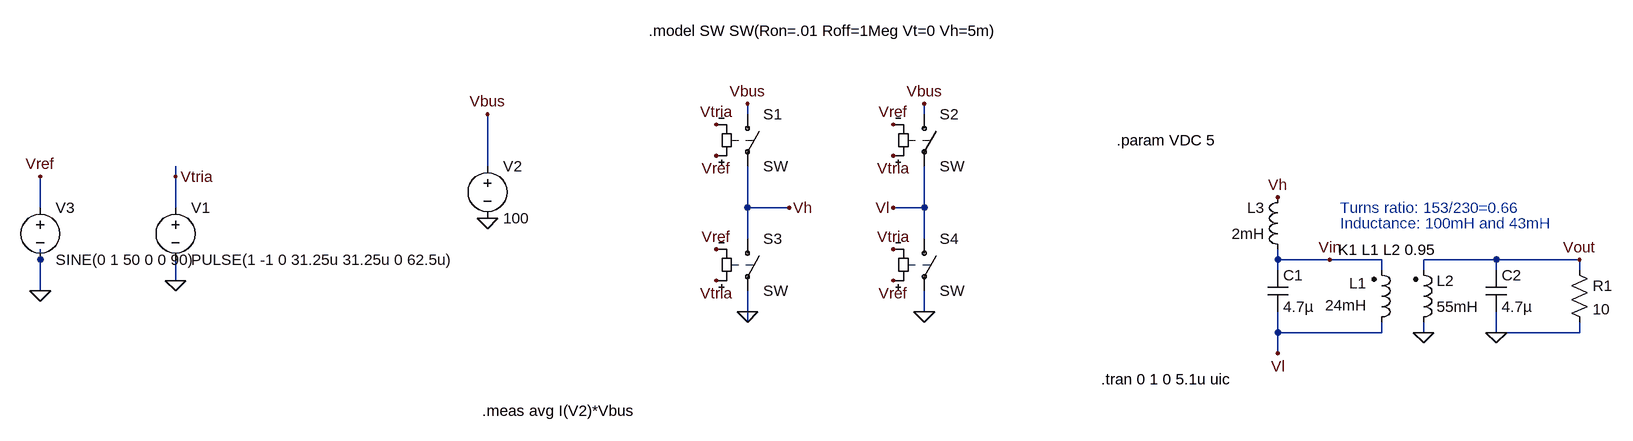
[diagram p0: schematic SB2500.asc]
SB2500.asc, the LTspice schematic file:
Version 4
SHEET 1 880 680
WIRE -1184 -128 -1184 -144
WIRE -912 -128 -912 -144
WIRE -1584 -48 -1584 -128
WIRE -2064 -32 -2064 -48
WIRE -2272 16 -2272 -32
WIRE -2064 16 -2064 -32
WIRE -1184 16 -1184 -48
WIRE -1120 16 -1184 16
WIRE -912 16 -912 -48
WIRE -912 16 -960 16
WIRE -1184 64 -1184 16
WIRE -912 64 -912 16
WIRE -2272 96 -2272 80
WIRE -368 96 -368 80
WIRE -288 96 -368 96
WIRE -208 96 -288 96
WIRE -32 96 -144 96
WIRE 96 96 -32 96
WIRE -368 112 -368 96
WIRE -208 112 -208 96
WIRE -144 112 -144 96
WIRE -32 112 -32 96
WIRE 96 112 96 96
WIRE -2064 128 -2064 96
WIRE -2272 144 -2272 96
WIRE -1184 176 -1184 144
WIRE -912 176 -912 144
WIRE -1184 192 -1184 176
WIRE -368 208 -368 176
WIRE -208 208 -208 192
WIRE -208 208 -368 208
WIRE -144 208 -144 192
WIRE -32 208 -32 176
WIRE 96 208 96 192
WIRE 96 208 -32 208
WIRE -368 240 -368 208
FLAG -144 208 0
FLAG -32 208 0
FLAG -368 0 Vh
FLAG -1584 32 0
FLAG -1184 176 0
FLAG -912 176 0
FLAG -1584 -128 Vbus
FLAG -1184 -144 Vbus
FLAG -912 -144 Vbus
FLAG -1120 16 Vh
FLAG -960 16 Vl
FLAG -2064 128 0
FLAG -2064 -32 Vtria
FLAG -2272 144 0
FLAG -2272 -32 Vref
FLAG -1232 -64 Vref
FLAG -1232 80 Vref
FLAG -960 -64 Vtria
FLAG -960 80 Vtria
FLAG -960 -112 Vref
FLAG -960 128 Vref
FLAG -368 240 Vl
FLAG -1232 -112 Vtria
FLAG -1232 128 Vtria
FLAG 96 96 Vout
FLAG -288 96 Vin
SYMBOL ind2 -224 208 M180
WINDOW 0 -7 76 Right 2
WINDOW 3 -7 42 Right 2
SYMATTR InstName L1
SYMATTR Value 24mH
SYMATTR Type ind
SYMATTR SpiceLine Rser=0.1
SYMBOL ind2 -160 208 M180
WINDOW 0 36 80 Left 2
WINDOW 3 36 40 Left 2
SYMATTR InstName L2
SYMATTR Value 55mH
SYMATTR Type ind
SYMATTR SpiceLine Rser=0.1
SYMBOL cap -384 112 R0
SYMATTR InstName C1
SYMATTR Value 4.7µ
SYMBOL ind -352 96 R180
WINDOW 0 36 80 Left 2
WINDOW 3 36 40 Left 2
SYMATTR InstName L3
SYMATTR Value 2mH
SYMBOL cap -48 112 R0
SYMATTR InstName C2
SYMATTR Value 4.7µ
SYMBOL sw -1184 -144 R0
SYMATTR InstName S1
SYMBOL sw -912 -144 R0
SYMATTR InstName S2
SYMBOL sw -1184 48 R0
SYMATTR InstName S3
SYMBOL sw -912 48 R0
SYMATTR InstName S4
SYMBOL voltage -1584 -64 R0
WINDOW 123 0 0 Left 0
WINDOW 39 0 0 Left 0
SYMATTR InstName V2
SYMATTR Value 100
SYMBOL voltage -2064 0 R0
WINDOW 123 0 0 Left 0
WINDOW 39 0 0 Left 0
SYMATTR InstName V1
SYMATTR Value PULSE(1 -1 0 31.25u 31.25u 0 62.5u)
SYMBOL voltage -2272 0 R0
WINDOW 123 0 0 Left 0
WINDOW 39 0 0 Left 0
SYMATTR InstName V3
SYMATTR Value SINE(0 1 50 0 0 90)
SYMBOL res 80 96 R0
SYMATTR InstName R1
SYMATTR Value 10
TEXT -200 96 Bottom 2 !K1 L1 L2 0.95
TEXT -616 -88 Left 2 !.param VDC 5
TEXT -640 280 Left 2 !.tran 0 1 0 5.1u uic
TEXT -1336 -256 Left 2 !.model SW SW(Ron=.01 Roff=1Meg Vt=0 Vh=5m)
TEXT -272 16 Left 2 ;Turns ratio: 153/230=0.66
TEXT -272 40 Left 2 ;Inductance: 100mH and 43mH
TEXT -1592 328 Left 2 !.meas avg I(V2)*Vbus

The netlist it stands for:
* SB2500.asc
L1 Vl Vin 24mH Rser=0.1
L2 0 Vout 55mH Rser=0.1
C1 Vin Vl 4.7µ
L3 Vin Vh 2mH
C2 Vout 0 4.7µ
S1 Vbus Vh Vref Vtria SW
S2 Vbus Vl Vtria Vref SW
S3 Vh 0 Vtria Vref SW
S4 Vl 0 Vref Vtria SW
V2 Vbus 0 100
V1 Vtria 0 PULSE(1 -1 0 31.25u 31.25u 0 62.5u)
V3 Vref 0 SINE(0 1 50 0 0 90)
R1 Vout 0 10
K1 L1 L2 0.95
.param VDC 5
.tran 0 1 0 5.1u uic
.model SW SW(Ron=.01 Roff=1Meg Vt=0 Vh=5m)
* Turns ratio: 153/230=0.66
* Inductance: 100mH and 43mH
.meas avg I(V2)*Vbus
.backanno
.end